# Altium project pca10090.PrjPCB (part 4 of 5)

## Sheet pca10090_sheet7_sim_connectors.SchDoc: PCA10090 - SIM & Connectors
size A3; Organization: Nordic Semiconductor; DocumentNumber: 7; Revision: 0.15.0; SheetNumber: 7; SheetTotal: 8; Author: RUBR; CompanyName: Nordic Semiconductor; DrawnBy: RUBR; DocumentSize: A3; ProjectName: nRF9160-DK
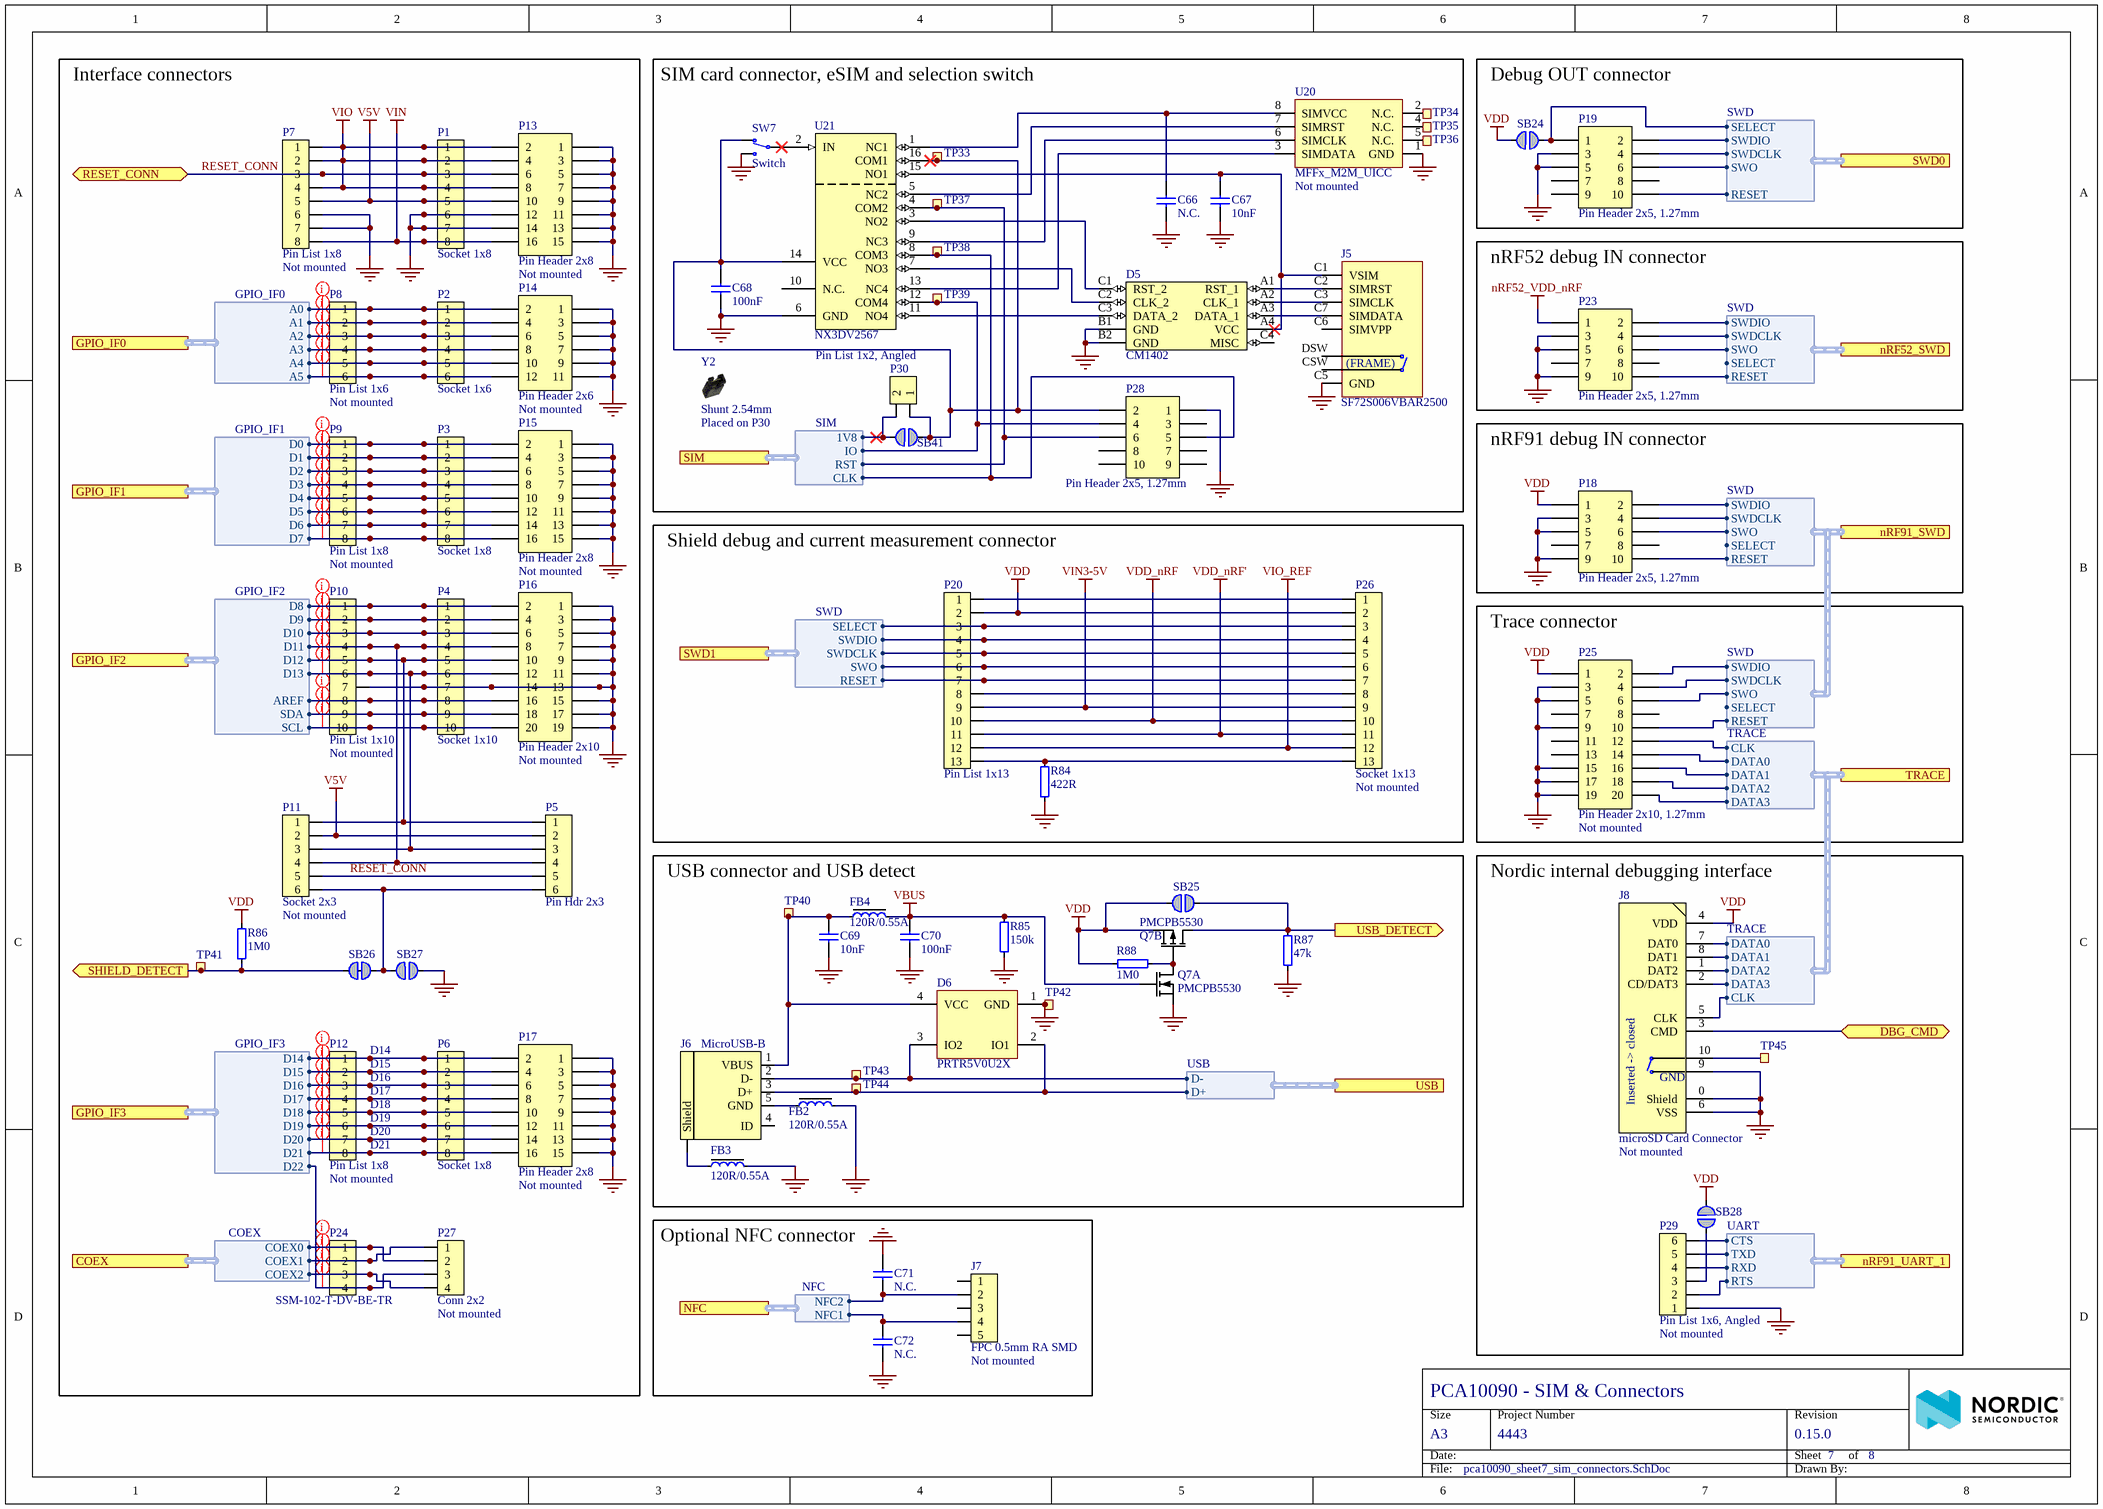
[diagram p6: pca10090_sheet7_sim_connectors.SchDoc]

### Parts
C66  N.C.  [CAPC0603X03L_C_NC]
C67  10nF  [CAPC0603X03L_C]
C68  100nF  [CAPC0603X03L_C]
C69  10nF  [CAPC0603X03L_C]
C70  100nF  [CAPC0603X03L_C]
C71  N.C.  [CAPC0603X03L_C_NC]
C72  N.C.  [CAPC0603X03L_C_NC]
D5  CM1402  [CM1402]
D6  PRTR5V0U2X  [SOT190P230X110-4L]
FB2  120R/0.55A  [INDC1005X04L]
FB3  120R/0.55A  [INDC1005X04L]
FB4  120R/0.55A  [INDC1005X04L]
J5  SF72S006VBAR2500  [SF72S006VBAR2500]
J6  MicroUSB-B  [USB-Micro-B-RA-SMD-PiP]
J7  FPC 0.5mm RA SMD  Assembly: Not mounted  [FPC_05P-0.5mm-RA-SMD]
J8  microSD Card Connector  Assembly: Not mounted  [Molex_502774-0891]
P1  Socket 1x8  [SOCKET_1x8_SMD]
P2  Socket 1x6  [SOCKET_1x6_SMD]
P3  Socket 1x8  [SOCKET_1x8_SMD]
P4  Socket 1x10  [SOCKET_1x10_SMD]
P5  Pin Hdr 2x3  [HDR_2x3-SMD]
P6  Socket 1x8  [SOCKET_1x8_SMD]
P7  Pin List 1x8  Assembly: Not mounted  [LIST_1x8_SMD-NC]
P8  Pin List 1x6  Assembly: Not mounted  [LIST_1x6_SMD-NC]
P9  Pin List 1x8  Assembly: Not mounted  [LIST_1x8_SMD-NC]
P10  Pin List 1x10  Assembly: Not mounted  [LIST_1x10_SMD-NC]
P11  Socket 2x3  Assembly: Not mounted  [SOCKET_2x3_SMD-2.54mm-bottom-NC]
P12  Pin List 1x8  Assembly: Not mounted  [LIST_1x8_SMD-NC]
P13  Pin Header 2x8  Assembly: Not mounted  [HDR_2x8-NC]
P14  Pin Header 2x6  Assembly: Not mounted  [HDR_2x6-NC]
P15  Pin Header 2x8  Assembly: Not mounted  [HDR_2x8-NC]
P16  Pin Header 2x10  Assembly: Not mounted  [HDR_2x10-NC]
P17  Pin Header 2x8  Assembly: Not mounted  [HDR_2x8-NC]
P18  Pin Header 2x5, 1.27mm  [HDR_2x5-SMD-1.27mm-K]
P19  Pin Header 2x5, 1.27mm  [HDR_2x5-SMD-1.27mm-K]
P20  Pin List 1x13  [LIST_1x13_SMD]
P23  Pin Header 2x5, 1.27mm  [HDR_2x5-SMD-1.27mm-K]
P24  SSM-102-T-DV-BE-TR  [SSM-102-T-DV-BE-TR]
P25  Pin Header 2x10, 1.27mm  Assembly: Not mounted  [HDR_2x10-SMD-1.27mm-NC]
P26  Socket 1x13  Assembly: Not mounted  [LIST_1x13_SMD-NC]
P27  Conn 2x2  Assembly: Not mounted  [HDR_2x2-SMD]
P28  Pin Header 2x5, 1.27mm  [HDR_2x5-SMD-1.27mm]
P29  Pin List 1x6, Angled  Assembly: Not mounted  [LIST_ANG_1x6-SMD-2.54MM]
P30  Pin List 1x2, Angled  [LIST_ANG_1x2-SMD-2.54MM]
Q7  PMCPB5530  [PMCPB5530X]  (parts A,B of 2)
R84  422R  [RESC0603X03L_C]
R85  150k  [RESC0603X03L_C]
R86  1M0  [RESC0603X03L_C]
R87  47k  [RESC0603X03L_C]
R88  1M0  [RESC0603X03L_C]
SB24  Solderbridge  [Solderbridge]  (value not drawn)  (no BOM)
SB25  Solderbridge  [Solderbridge]  (value not drawn)  (no BOM)
SB26  Solderbridge  [Solderbridge_Shorted]  (value not drawn)  (net tie, no BOM)
SB27  Solderbridge  [Solderbridge]  (value not drawn)  (no BOM)
SB28  Solderbridge  [Solderbridge]  (value not drawn)  (no BOM)
SB41  Solderbridge  [Solderbridge]  (value not drawn)  (no BOM)
SW7  Switch  [CJS-120xA]
TP33  Ø1.5mm,SMD  [TP_SMD_Ø1.5mm]  (value not drawn)  (no BOM)
TP34  Ø1.0mm,SMD  [TP_SMD_Ø1.0mm]  (value not drawn)  (no BOM)
TP35  Ø1.0mm,SMD  [TP_SMD_Ø1.0mm]  (value not drawn)  (no BOM)
TP36  Ø1.0mm,SMD  [TP_SMD_Ø1.0mm]  (value not drawn)  (no BOM)
TP37  Ø1.5mm,SMD  [TP_SMD_Ø1.5mm]  (value not drawn)  (no BOM)
TP38  Ø1.5mm,SMD  [TP_SMD_Ø1.5mm]  (value not drawn)  (no BOM)
TP39  Ø1.5mm,SMD  [TP_SMD_Ø1.5mm]  (value not drawn)  (no BOM)
TP40  Ø1.5mm,SMD  [TP_SMD_Ø1.5mm]  (value not drawn)  (no BOM)
TP41  Ø1.5mm,SMD  [TP_SMD_Ø1.5mm]  (value not drawn)  (no BOM)
TP42  Ø1.5mm,SMD  [TP_SMD_Ø1.5mm]  (value not drawn)  (no BOM)
TP43  Ø1.5mm,SMD  [TP_SMD_Ø1.5mm]  (value not drawn)  (no BOM)
TP44  Ø1.5mm,SMD  [TP_SMD_Ø1.5mm]  (value not drawn)  (no BOM)
TP45  Ø1.5mm,SMD  [TP_SMD_Ø1.5mm]  (value not drawn)  (no BOM)
U20  MFFx_M2M_UICC  Assembly: Not mounted  [SON127P600X90_HS-8N]
U21  NX3DV2567  [XQFN40P180X260X50-16N]
Y2  Shunt 2.54mm  Assembly: Placed on P30  [Shunt_2.54mm_Horizontal]

### Blocks framed on the sheet
Interface connectors: P1-P17 P24 P27 R86 SB26 SB27 TP41
SIM card connector, eSIM and selection switch: C66-C68 D5 J5 P28 P30 SB41 SW7 TP33-TP39 U20 U21 Y2
Debug OUT connector: P19 SB24
nRF52 debug IN connector: P23
nRF91 debug IN connector: P18
Shield debug and current measurement connector: P20 P26 R84
Trace connector: P25
USB connector and USB detect: C69 C70 D6 FB2-FB4 J6 Q7 R85 R87 R88 SB25 TP40 TP42-TP44
Nordic internal debugging interface: J8 P29 SB28 TP45
Optional NFC connector: C71 C72 J7

### Ports
COEX (harness COEX), DBG_CMD (bidir), GPIO_IF0 (harness GPIO_IF0), GPIO_IF1 (harness GPIO_IF1), GPIO_IF2 (harness GPIO_IF2), GPIO_IF3 (harness GPIO_IF3), NFC (harness NFC), nRF52_SWD (harness SWD), nRF91_SWD (harness SWD), nRF91_UART_1 (harness UART), RESET_CONN (bidir), SHIELD_DETECT (out), SIM (harness SIM), SWD0 (harness SWD), SWD1 (harness SWD), TRACE (harness TRACE), USB (harness USB), USB_DETECT (out)

### Harnesses
SWD: SWDIO, SWDCLK, SWO, RESET, SELECT
GPIO_IF0: A0, A1, A2, A3, A4, A5
GPIO_IF1: D0, D1, D2, D3, D4, D5, D6, D7
GPIO_IF2: D8, D9, D10, D11, D12, D13, AREF, SDA, SCL
GPIO_IF3: D14, D15, D16, D17, D18, D19, D20, D21, D22
NFC: NFC1, NFC2
COEX: COEX0, COEX2, COEX1
TRACE: CLK, DATA0, DATA1, DATA3, DATA2
SIM: CLK, IO, 1V8, RST
USB: D+, D-
UART: RTS, CTS, RXD, TXD

### Nets
GND: C66.1 C67.2 C68.1 C69.1 C70.1 C71.2 C72.1 D5.B1(GND) D5.B2(GND) D6.1(GND) FB2.2 FB3.2 J5.0(GND) J5.C5(GND) J8.0(Shield) J8.6(VSS) J8.9 P1.6 P1.7 P4.7 P7.6 P7.7 P10.7 P13.1 P13.3 P13.5 P13.7 P13.9 P13.11 P13.12 P13.13 P13.14 P13.15 P14.1 P14.3 P14.5 P14.7 P14.9 P14.11 P15.1 P15.3 P15.5 P15.7 P15.9 P15.11 P15.13 P15.15 P16.1 P16.3 P16.5 P16.7 P16.9 P16.11 P16.13 P16.14 P16.15 P16.17 P16.19 P17.1 P17.3 P17.5 P17.7 P17.9 P17.11 P17.13 P17.15 P18.3 P18.5 P18.9 P19.3 P19.5 P23.3 P23.5 P23.9 P25.3 P25.5 P25.9 P25.15 P25.17 P25.19 P28.1 P29.1 Q7.1(S1) R84.1 R85.1 R87.1 SB27.1 SW7.3(N.O) TP42.1 U20.1(GND) U21.6(GND)
nRF52_VDD_nRF: P23.1
V5V: P1.5 P5.2 P7.5 P11.2 P13.10
VBUS: C70.2 FB4.2 Q7.2(G1) R85.2
VDD: J8.4(VDD) P18.1 P20.2 P25.1 P26.2 Q7.4(S2) R86.2 R88.1 SB24.2 SB25.1 SB28.1
VDD_nRF: P20.10 P26.10
VDD_nRF': P20.11 P26.11
VIN: P1.8 P7.8 P13.16
VIN3-5V: P20.9 P26.9
VIO: P1.1 P1.2 P1.4 P7.1 P7.2 P7.4 P13.2 P13.4 P13.8
VIO_REF: P20.12 P26.12
COEX1: P24.2 P27.1 ; port COEX.COEX1
COEX2: P24.3 P27.4 ; port COEX.COEX2
D_N: D6.3(IO2) J6.2(D-) TP43.1 ; port USB.D-
D_P: D6.2(IO1) J6.3(D+) TP44.1 ; port USB.D+
GPS_EN: P24.1 P27.2 ; port COEX.COEX0
nRF52_P0.02/AIN0: R86.1 SB26.2 TP41.1 ; port SHIELD_DETECT
nRF52_P0.09/NFC1: C72.2 J7.4 ; port NFC.NFC1
nRF52_P0.10/NFC2: C71.1 J7.2 ; port NFC.NFC2
nRF52_P0.18/RESET: P23.10 ; port nRF52_SWD.RESET
nRF52_P1.00: P23.6 ; port nRF52_SWD.SWO
nRF52_SWDCLK: P23.4 ; port nRF52_SWD.SWDCLK
nRF52_SWDIO: P23.2 ; port nRF52_SWD.SWDIO
P0.00: P3.1 P9.1 P15.2 ; port GPIO_IF1.D0
P0.01: P3.2 P9.2 P15.4 ; port GPIO_IF1.D1
P0.02: P3.3 P9.3 P15.6 ; port GPIO_IF1.D2
P0.03: P3.4 P9.4 P15.8 ; port GPIO_IF1.D3
P0.04: P3.5 P9.5 P15.10 ; port GPIO_IF1.D4
P0.05: P3.6 P9.6 P15.12 ; port GPIO_IF1.D5
P0.06: P3.7 P9.7 P15.14 ; port GPIO_IF1.D6
P0.07: P3.8 P9.8 P15.16 ; port GPIO_IF1.D7
P0.08: P4.1 P10.1 P16.2 ; port GPIO_IF2.D8
P0.09: P4.2 P10.2 P16.4 ; port GPIO_IF2.D9
P0.10: P4.3 P10.3 P16.6 ; port GPIO_IF2.D10
P0.11: P4.4 P5.4 P10.4 P11.4 P16.8 ; port GPIO_IF2.D11
P0.12: P4.5 P5.1 P10.5 P11.1 P16.10 ; port GPIO_IF2.D12
P0.13/AIN0: P4.6 P5.3 P10.6 P11.3 P16.12 ; port GPIO_IF2.D13
P0.14/AIN1: P2.1 P8.1 P14.2 ; port GPIO_IF0.A0
P0.15/AIN2: P2.2 P8.2 P14.4 ; port GPIO_IF0.A1
P0.16/AIN3: P2.3 P8.3 P14.6 ; port GPIO_IF0.A2
P0.17/AIN4: P2.4 P8.4 P14.8 ; port GPIO_IF0.A3
P0.18/AIN5: P2.5 P8.5 P14.10 ; port GPIO_IF0.A4
P0.19/AIN6: P2.6 P8.6 P14.12 ; port GPIO_IF0.A5
P0.20/AIN7: P4.8 P10.8 P16.16 ; port GPIO_IF2.AREF
P0.21: J8.5(CLK) P6.1 P12.1 P17.2 P25.12 ; port GPIO_IF3.D14, port TRACE.CLK
P0.22: J8.7(DAT0) P6.2 P12.2 P17.4 P18.6 P25.6 P25.14 ; port nRF91_SWD.SWO, port GPIO_IF3.D15, port TRACE.DATA0
P0.23: J8.8(DAT1) P6.3 P12.3 P17.6 P25.16 ; port GPIO_IF3.D16, port TRACE.DATA1
P0.24: J8.1(DAT2) P6.4 P12.4 P17.8 P25.18 ; port GPIO_IF3.D17, port TRACE.DATA2
P0.25: J8.2(CD/DAT3) P6.5 P12.5 P17.10 P25.20 ; port GPIO_IF3.D18, port TRACE.DATA3
P0.26: P6.6 P12.6 P17.12 P29.6 ; port GPIO_IF3.D19, port nRF91_UART_1.CTS
P0.27: P6.7 P12.7 P17.14 P29.2 ; port GPIO_IF3.D20, port nRF91_UART_1.RTS
P0.28: P6.8 P12.8 P17.16 P29.4 ; port GPIO_IF3.D21, port nRF91_UART_1.RXD
P0.29: P24.4 P27.3 P29.5 ; port GPIO_IF3.D22, port nRF91_UART_1.TXD
P0.30: P4.9 P10.9 P16.18 ; port GPIO_IF2.SDA
P0.31: P4.10 P10.10 P16.20 ; port GPIO_IF2.SCL
RESET: P18.10 P25.10 ; port nRF91_SWD.RESET
RESET_CONN: P1.3 P5.5 P7.3 P11.5 P13.6 ; port RESET_CONN
SIM_1V8: P30.2 SB41.1 ; port SIM.1V8
SIM_CLK: P28.5 TP38.1 U21.8(COM3) ; port SIM.CLK
SIM_IO: P28.4 TP39.1 U21.12(COM4) ; port SIM.IO
SIM_RST: P28.6 TP37.1 U21.4(COM2) ; port SIM.RST
SWD0_CLK: P19.4 ; port SWD0.SWDCLK
SWD0_IO: P19.2 ; port SWD0.SWDIO
SWD0_RESET: P19.10 ; port SWD0.RESET
SWD0_SEL: P19.1 SB24.1 ; port SWD0.SELECT
SWD0_SWO: P19.6 ; port SWD0.SWO
SWD1_CLK: P20.5 P26.5 ; port SWD1.SWDCLK
SWD1_IO: P20.4 P26.4 ; port SWD1.SWDIO
SWD1_RESET: P20.7 P26.7 ; port SWD1.RESET
SWD1_SEL: P20.3 P26.3 ; port SWD1.SELECT
SWD1_SWO: P20.6 P26.6 ; port SWD1.SWO
SWDCLK: P18.4 P25.4 ; port nRF91_SWD.SWDCLK
SWDIO: P18.2 P25.2 ; port nRF91_SWD.SWDIO
NetC66_2: C66.2 U20.8(SIMVCC) U21.1(NC1)
NetC67_1: C67.1 D5.A4(VCC) J5.C1(VSIM) U21.15(NO1)
NetC68_2: C68.2 P28.2 P30.1 SB41.2 SW7.1(N.C) TP33.1 U21.14(VCC) U21.16(COM1)
NetC69_2: C69.2 D6.4(VCC) FB4.1 J6.1(VBUS) TP40.1
NetD5_A1: D5.A1(RST_1) J5.C2(SIMRST)
NetD5_A2: D5.A2(CLK_1) J5.C3(SIMCLK)
NetD5_A3: D5.A3(DATA_1) J5.C7(SIMDATA)
NetD5_C1: D5.C1(RST_2) U21.3(NO2)
NetD5_C2: D5.C2(CLK_2) U21.7(NO3)
NetD5_C3: D5.C3(DATA_2) U21.11(NO4)
NetFB2_1: FB2.1 J6.5(GND)
NetFB3_1: FB3.1 J6.6(Shield)
NetJ8_3: J8.3(CMD) ; port DBG_CMD
NetJ8_10: J8.10 TP45.1
NetP5_6: P5.6 P11.6 SB26.1 SB27.2
NetP20_1: P20.1 P26.1
NetP20_8: P20.8 P26.8
NetP20_13: P20.13 P26.13 R84.2
NetP29_3: P29.3 SB28.2
NetQ7_3: Q7.3(D2) R87.2 SB25.2 ; port USB_DETECT
NetQ7_5: Q7.5(G2) Q7.6(D1) R88.2
NetSW7_2: SW7.2(COM) U21.2(IN)
NetTP34_1: TP34.1 U20.2(N.C.)
NetTP35_1: TP35.1 U20.4(N.C.)
NetTP36_1: TP36.1 U20.5(N.C.)
NetU20_3: U20.3(SIMDATA) U21.13(NC4)
NetU20_6: U20.6(SIMCLK) U21.9(NC3)
NetU20_7: U20.7(SIMRST) U21.5(NC2)

Not connected (* = marked no-connect by the designer): D5 C4(MISC); J5 C6(SIMVPP) CSW DSW; J6 4(ID); J7 1 3 5; P18 7 8; P19 7 8 9; P23 7 8; P25 7 8 11 13; P28 3 7 8 9 10; U21 10(N.C.)

### Layout directives
net class GPIO: COEX1, COEX2, GPS_EN, P0.00, P0.01, P0.02, P0.03, P0.04, P0.05, P0.06, P0.07, P0.08, P0.09, P0.10, P0.11, P0.12, P0.13/AIN0, P0.14/AIN1, P0.15/AIN2, P0.16/AIN3, P0.17/AIN4, P0.18/AIN5, P0.19/AIN6, P0.20/AIN7, P0.21, P0.22, P0.23, P0.24, P0.25, P0.26, P0.27, P0.28, P0.29, P0.30, P0.31

### Notes on the sheet
- (near P12) D14
- (near P12) D15
- (near P12) D16
- (near P12) D17
- (near P12) D18
- (near P12) D19
- (near P12) D20
- (near P12) D21
- Size
- Date:
- A3
- Project Number
- Sheet         of
- Revision
- File:
- Drawn By:
- (in symbol Bellwether 10104-1021) GND; Inserted -> closed
- (in symbol SF72S006VBAR2500) (FRAME)

### Library data of the parts
C66 C71 C72 = C0201-N.C.: Not mounted; Note: Chip Cap; Artikkelnr Noca: N.A.; Assembly: Not mounted; Part Number: C0201-N.C.; Manufacturer: *; Manufacturer Part Number: *; ComponentLink1URL: *; ComponentLink1Description: Datasheet; ComponentLink2URL: *; ComponentLink2Description: Supplier link; HelpURL: *; Footprint Doc: 0201; LatestRevisionDate: 2014-11-13; Pin Count: 2; Publisher: Nordic Semiconductor; Published: 2014-11-13; Value: N.C.; Part number IPS: N.A.; Supplier 1: *; Supplier Part Number 1: *; Supplier 2: *; Supplier Part Number 2: *
C67 C69 = C0201-10n: Capacitor, X7R, ±10%; Part number IPS: 00000003480; Note: 10V; Artikkelnr Noca: N.A.; Part Number: C0201-10n; Manufacturer: *; Manufacturer Part Number: *; ComponentLink1URL: *; ComponentLink1Description: Datasheet; ComponentLink2URL: *; ComponentLink2Description: Supplier link; HelpURL: *; Footprint Doc: 0201; LatestRevisionDate: 2017-11-09; Pin Count: 2; Publisher: Nordic Semiconductor; Published: 2014-11-13; Value: 10nF; Supplier 1: *; Supplier Part Number 1: *; Supplier 2: *; Supplier Part Number 2: *
C68 C70 = C0201-100n: as C48-C55 on sheet pca10090_sheet5_signal_switches; Part Number: C0201-100n; Manufacturer: *; Manufacturer Part Number: *; ComponentLink1URL: *; ComponentLink1Description: Datasheet; ComponentLink2URL: *; ComponentLink2Description: Supplier link; HelpURL: *; Footprint Doc: 0201; LatestRevisionDate: 2017-11-09; Pin Count: 2; Publisher: Nordic Semiconductor; Published: 2014-11-13; Value: 100nF; Supplier 1: *; Supplier Part Number 1: *; Supplier 2: *; Supplier Part Number 2: *
D5 = CM1402: EMI Network Filter Arrays SIM CARD EMI FILTER WITH ESD PROTECTION; Manufacturer: ON Semiconductor; Manufacturer Part Number: CM1402-03CP; Part number IPS: 00000009949; Artikkelnr Noca: N.A.; Part Number: CM1402; Footprint Doc: CM1402; LatestRevisionDate: 2017-02-06; Publisher: Nordic Semiconductor; Published: 2017-02-06; Value: CM1402; Note: *; ComponentLink1URL: *; ComponentLink1Description: Datasheet; ComponentLink2URL: *; ComponentLink2Description: Supplier link; HelpURL: http://www.onsemi.com/pub_link/Collateral/CM1402-D.PDF; Pin Count: 10; Supplier 1: Digi-Key; Supplier Part Number 1: CM1402-03CPOSTR-ND; Supplier 2: Mouser; Supplier Part Number 2: 748-CM1402-03CP
D6 = PRTR5V0U2X: Ultra low capacitance double rail-to-rail ESD protection diode; Manufacturer: NXP; Part number IPS: 00000009951; Artikkelnr Noca: 10069015; Part Number: PRTR5V0U2X; Manufacturer Part Number: PRTR5V0U2X; LatestRevisionDate: 2017-11-09; Publisher: Nordic Semiconductor; Published: 2012-06-11; Value: PRTR5V0U2X; Note: *; Footprint Doc: SOT-143B; ComponentLink1URL: *; ComponentLink1Description: Datasheet; ComponentLink2URL: *; ComponentLink2Description: Supplier link; HelpURL: http://www.farnell.com/datasheets/109718.pdf; Pin Count: 4; Supplier 1: Digi-Key; Supplier Part Number 1: 568-4140-1-ND; Supplier 2: Farnell; Supplier Part Number 2: 152-4157
FB2-FB4 = FB0402-120R@100M-500mA: Ferrite Bead, 120 Ohm @ 100MHz, 500mA, 250 mOhm Max; Manufacturer: Murata; Manufacturer Part Number: BLM15AG121SN1D; Part number IPS: 00000009954; Note: Chip EMIFIL Inductor Type Chip Ferrite Bead; Artikkelnr Noca: 33029317; Part Number: FB0402-120R@100M-500mA; Footprint Doc: 0402; LatestRevisionDate: 2014-01-10; Pin Count: 2; Publisher: Nordic Semiconductor; Published: 2011-11-14; Value: 120R/0.55A; ComponentLink1URL: *; ComponentLink1Description: Datasheet; ComponentLink2URL: *; ComponentLink2Description: Supplier link; HelpURL: http://search.murata.co.jp/Ceramy/image/img/PDF/ENG/L0110S0100BLM15A_SN.pdf; Supplier 1: Digi-Key; Supplier Part Number 1: 490-1005-1-ND; Supplier 2: Farnell; Supplier Part Number 2: 151-5760
J5 = SF72S006VBAR2500: n 8 (6 + 2) Position Card Connector NANO SIM Surface Mount, Right Angle Gold; Manufacturer: JAE; Part number IPS: 00000009956; Artikkelnr Noca: N.A.; Part Number: SF72S006VBAR2500; Manufacturer Part Number: SF72S006VBAR2500; Footprint Doc: SF72S006VBAR2500; LatestRevisionDate: 2016-09-09; Pin Count: 8; Publisher: Nordic Semiconductor; Published: 2016-09-09; Value: SF72S006VBAR2500; Note: *; ComponentLink1URL: *; ComponentLink1Description: Datasheet; ComponentLink2URL: *; ComponentLink2Description: Supplier link; HelpURL: http://jae-connectors.com/en/pdf/MB-0282-1E_SF72.pdf; Supplier 1: Digi-Key; Supplier Part Number 1: 670-2799-1-ND; Supplier 2: Mouser; Supplier Part Number 2: 656-SF72S006VBAR2500
J6 = USB-Micro-B-RA-SMD-PiP: MicroUSB-B-SMT; Manufacturer: Allen Creations Corp.; Manufacturer Part Number: AJU55-BS2111-L; Part number IPS: 00000007790; Artikkelnr Noca: 55029020; Part Number: USB-Micro-B-RA-SMD-PiP; Footprint Doc: USB-Micro-B-RA-SMD-PiP; LatestRevisionDate: 2016-04-21; Pin Count: 5; Publisher: Nordic Semiconductor; Published: 2014-10-07; Value: MicroUSB-B; Note: *; ComponentLink1URL: *; ComponentLink1Description: Datasheet; ComponentLink2URL: *; ComponentLink2Description: Supplier link; HelpURL: \\hizz\pro\app9717\Datasheet\connectors\Allen Creations Corp\AJU-211.pdf; Supplier 1: Cabcon; Supplier Part Number 1: AJU55-BS2111-L; Supplier 2: Digi-Key; Supplier Part Number 2: 609-4616-1-ND
J7 = FPC_05P-0.5mm-RA-SMD: 0.5mm FPC, 5P,Right Angle SMT,Double Contact,H=1.2mm,White, Tin plated; Manufacturer: W-CON; Manufacturer Part Number: 5141-05RZDNWR01; Part number IPS: 00000007792; Artikkelnr Noca: 55010020; Part Number: FPC_05P-0.5mm-RA-SMD; Footprint Doc: FPC_05P-0.5mm-RA-SMD; LatestRevisionDate: 2016-04-21; Pin Count: 7; Publisher: Nordic Semiconductor; Published: 2015-06-22; Value: FPC 0.5mm RA SMD; Note: *; ComponentLink1URL: *; ComponentLink1Description: Datasheet; ComponentLink2URL: *; ComponentLink2Description: Supplier link; HelpURL: \\hizz\pro\app9717\Datasheet\connectors\W-CON\5141-XXRZDNXX0X.pdf; Supplier 1: Cabcon; Supplier Part Number 1: 5141-05RZDNWR01; Supplier 2: Digi-Key; Supplier Part Number 2: WM9836CT-ND
J8 = Bellwether 10104-1021: 1.10mm Pitch microSD Memory Card Connector, Reverse Mount Surface Mount, Push-Push Type; Artikkelnr Noca: N.A.; Part Number: Bellwether 10104-1021; Manufacturer: Bellwether; Manufacturer Part Number: 10104-1021; ComponentLink1URL: *; ComponentLink1Description: Datasheet; ComponentLink2URL: *; ComponentLink2Description: Supplier link; HelpURL: *; Footprint Doc: MicroSD; LatestRevisionDate: 2020-06-12; Pin Count: 14; Publisher: Nordic Semiconductor; Published: 2020-06-12; Value: microSD Card Connector; Note: *; Supplier 1: Cabcon; Supplier Part Number 1: 10104-1021; Supplier 2: *; Supplier Part Number 2: *; Part number IPS: N.A.
P1 P3 P6 = Socket 1x8 SMD: Socket 1x8, 2.54mm (100mil), SMD; Manufacturer: W-CON; Manufacturer Part Number: 2171-108MS0CUNR1; Part number IPS: 00000009963; Artikkelnr Noca: 55030002; Part Number: Socket 1x8 SMD; Footprint Doc: SOCKET_1x8_SMD; LatestRevisionDate: 2017-10-23; Pin Count: 8; Publisher: Nordic Semiconductor; Published: 2016-01-22; Value: Socket 1x8; Note: *; ComponentLink1URL: *; ComponentLink1Description: Datasheet; ComponentLink2URL: *; ComponentLink2Description: Supplier link; HelpURL: *; Supplier 1: Cabcon; Supplier Part Number 1: 2171-108MS0CUNR1; Supplier 2: Samtec; Supplier Part Number 2: SSM-108-F-SV-P-TR
P2 = Socket 1x6 SMD: Socket 1x6, 2.54mm (100mil), SMD; Manufacturer: W-CON; Manufacturer Part Number: 2171-106MS0CUNR1; Part number IPS: 00000009964; Artikkelnr Noca: 55030001; Part Number: Socket 1x6 SMD; Footprint Doc: SOCKET_1x6_SMD; LatestRevisionDate: 2017-10-23; Pin Count: 6; Publisher: Nordic Semiconductor; Published: 2016-01-22; Value: Socket 1x6; Note: *; ComponentLink1URL: *; ComponentLink1Description: Datasheet; ComponentLink2URL: *; ComponentLink2Description: Supplier link; HelpURL: *; Supplier 1: Cabcon; Supplier Part Number 1: 2171-106MS0CUNR1; Supplier 2: Samtec; Supplier Part Number 2: SSM-106-F-SV-P-TR
P4 = Socket 1x10 SMD: Socket 1x10, 2.54mm (100mil), SMD; Manufacturer: W-CON; Manufacturer Part Number: 2171-110MS0CUNR1; Part number IPS: 00000009965; Artikkelnr Noca: 55030004; Part Number: Socket 1x10 SMD; Footprint Doc: SOCKET_1x10_SMD; LatestRevisionDate: 2016-01-22; Pin Count: 10; Publisher: Nordic Semiconductor; Published: 2016-01-22; Value: Socket 1x10; Note: *; ComponentLink1URL: *; ComponentLink1Description: Datasheet; ComponentLink2URL: *; ComponentLink2Description: Supplier link; HelpURL: *; Supplier 1: Cabcon; Supplier Part Number 1: 2171-110MS0CUNR1; Supplier 2: Samtec; Supplier Part Number 2: SSM-110-F-SV-P-TR
P5 = Pin Header 2x3 SMD: Pin Header 2x3, 2.54mm (100mil) SMD; Manufacturer: W-CON; Manufacturer Part Number: 1125-1203S0M116R1; Part number IPS: 00000009966; Artikkelnr Noca: 55010007; Part Number: Pin Header 2x3 SMD; Footprint Doc: HDR_2x3-SMD; LatestRevisionDate: 2016-01-22; Pin Count: 6; Publisher: Nordic Semiconductor; Published: 2016-01-22; Value: Pin Hdr 2x3; Note: SMD; ComponentLink1URL: *; ComponentLink1Description: Datasheet; ComponentLink2URL: *; ComponentLink2Description: Supplier link; HelpURL: \\hizz\pro\app9717\Datasheet\connectors\W-CON\1125-12XXXXMXXXXX.PDF; Supplier 1: Cabcon; Supplier Part Number 1: 1125-1203S0M116R1; Supplier 2: Samtec; Supplier Part Number 2: TSM-103-01-L-DV
P7 P9 P12 = Pin List 1x8 SMD, N.C.: Pin List 1x8, 2.54mm (100mil), SMD; Manufacturer: W-CON; Manufacturer Part Number: 1125-1108S0M116R2; Part number IPS: N.A.; Artikkelnr Noca: 55010006; Part Number: Pin List 1x8 SMD, N.C.; LatestRevisionDate: 2016-01-22; Publisher: Nordic Semiconductor; Published: 2016-01-22; Value: Pin List 1x8; Note: *; Pin Count: 8; Footprint Doc: LIST_1x8_SMD; ComponentLink1URL: *; ComponentLink1Description: Datasheet; ComponentLink2URL: *; ComponentLink2Description: Supplier link; HelpURL: \\hizz\pro\app9717\Datasheet\connectors\W-CON\1125-11XXXXMXXXXX.pdf; Supplier 1: Cabcon; Supplier Part Number 1: 1125-1108S0M116R2; Supplier 2: Samtec; Supplier Part Number 2: TSM-108-01-L-SV-P-TR
P8 = Pin List 1x6 SMD, N.C.: Pin List 1x6, 2.54mm (100mil), SMD; Manufacturer: W-CON; Manufacturer Part Number: 1125-1106S0M116R2; Part number IPS: N.A.; Artikkelnr Noca: 55010026; Part Number: Pin List 1x6 SMD, N.C.; LatestRevisionDate: 2016-03-29; Pin Count: 6; Publisher: Nordic Semiconductor; Published: 2016-03-29; Value: Pin List 1x6; Note: *; Footprint Doc: LIST_1x6_SMD; ComponentLink1URL: *; ComponentLink1Description: Datasheet; ComponentLink2URL: *; ComponentLink2Description: Supplier link; HelpURL: \\hizz\pro\app9717\Datasheet\connectors\W-CON\1125-11XXXXMXXXXX.pdf; Supplier 1: Cabcon; Supplier Part Number 1: 1125-1106S0M116R2; Supplier 2: Samtec; Supplier Part Number 2: TSM-106-01-L-SV-P-TR
P10 = Pin List 1x10 SMD, N.C.: Pin List 1x10, 2.54mm (100mil), SMD; Manufacturer: W-CON; Manufacturer Part Number: 1125-1110S0M116R2; Part number IPS: N.A.; Artikkelnr Noca: 55010028; Part Number: Pin List 1x10 SMD, N.C.; LatestRevisionDate: 2016-03-29; Publisher: Nordic Semiconductor; Published: 2016-03-29; Value: Pin List 1x10; Note: *; Pin Count: 10; Footprint Doc: LIST_1x10_SMD; ComponentLink1URL: *; ComponentLink1Description: Datasheet; ComponentLink2URL: *; ComponentLink2Description: Supplier link; HelpURL: \\hizz\pro\app9717\Datasheet\connectors\W-CON\1125-11XXXXMXXXXX.pdf; Supplier 1: Cabcon; Supplier Part Number 1: 1125-1110S0M116R2; Supplier 2: Samtec; Supplier Part Number 2: TSM-110-01-L-SV-P-TR
P11 = Socket 2x3 SMD Bottom, N.C.: Socket 2x3, 2.54mm (100mil), SMD; Manufacturer: W-CON; Manufacturer Part Number: 2171-203MS0CUNR1; Part number IPS: N.A.; Artikkelnr Noca: 55030010; Part Number: Socket 2x3 SMD Bottom, N.C.; LatestRevisionDate: 2016-03-29; Pin Count: 6; Publisher: Nordic Semiconductor; Published: 2014-06-10; Value: Socket 2x3; Note: *; Footprint Doc: SOCKET_2x3_SMD-2.54mm-bottom; ComponentLink1URL: *; ComponentLink1Description: Datasheet; ComponentLink2URL: *; ComponentLink2Description: Supplier link; HelpURL: \\hizz\pro\app9717\Datasheet\connectors\W-CON\2171-2XXMXXCUNXX.pdf; Supplier 1: Cabcon; Supplier Part Number 1: 2171-203MS0CUNR1; Supplier 2: Samtec; Supplier Part Number 2: SSM-103-F-DV-P-TR
P13 P15 P17 = Pin Header 2x8, N.C.: Pin Header 2x8, 2.54mm (100mil); Artikkelnr Noca: N.A.; Part Number: Pin Header 2x8, N.C.; Manufacturer: *; Manufacturer Part Number: *; Footprint Doc: HDR_2x8; LatestRevisionDate: 2009-12-12; Pin Count: 16; Publisher: Nordic Semiconductor; Published: 2009-12-12; Value: Pin Header 2x8; Note: *; Part number IPS: N.A.; ComponentLink1URL: *; ComponentLink1Description: Datasheet; ComponentLink2URL: *; ComponentLink2Description: Supplier link; HelpURL: *; Supplier 1: *; Supplier Part Number 1: *; Supplier 2: *; Supplier Part Number 2: *
P14 = Pin Header 2x6, N.C.: Pin Header 2x6, 2.54mm (100mil); Artikkelnr Noca: N.A.; Part Number: Pin Header 2x6, N.C.; Manufacturer: *; Manufacturer Part Number: *; Footprint Doc: HDR_2x6; LatestRevisionDate: 2014-07-04; Pin Count: 12; Publisher: Nordic Semiconductor; Published: 2009-12-12; Value: Pin Header 2x6; Note: *; Part number IPS: N.A.; ComponentLink1URL: *; ComponentLink1Description: Datasheet; ComponentLink2URL: *; ComponentLink2Description: Supplier link; HelpURL: *; Supplier 1: *; Supplier Part Number 1: *; Supplier 2: *; Supplier Part Number 2: *
P16 = Pin Header 2x10, N.C.: Pin Header 2x10, 2.54mm (100mil); Artikkelnr Noca: N.A.; Part Number: Pin Header 2x10, N.C.; Manufacturer: *; Manufacturer Part Number: *; Footprint Doc: HDR_2x10; LatestRevisionDate: 2017-02-02; Pin Count: 20; Publisher: Nordic Semiconductor; Published: 2017-01-30; Value: Pin Header 2x10; Note: *; Part number IPS: N.A.; ComponentLink1URL: *; ComponentLink1Description: Datasheet; ComponentLink2URL: *; ComponentLink2Description: Supplier link; HelpURL: *; Supplier 1: *; Supplier Part Number 1: *; Supplier 2: *; Supplier Part Number 2: *
P18 P19 P23 = Pin Header 2x5 SMD, 1.27mm, KS: Pin Header 2x5, 1.27mm (50mil), SMD, Keying Shroud; Manufacturer: W-CON; Manufacturer Part Number: 3132-10MS0BK00R1; Part number IPS: 00000009968; Artikkelnr Noca: 55010009; Part Number: Pin Header 2x5 SMD, 1.27mm, KS; Footprint Doc: HDR_2x5-SMD-1.27mm; LatestRevisionDate: 2016-04-21; Pin Count: 10; Publisher: Nordic Semiconductor; Published: 2016-01-22; Value: Pin Header 2x5, 1.27mm; Note: *; ComponentLink1URL: *; ComponentLink1Description: Datasheet; ComponentLink2URL: *; ComponentLink2Description: Supplier link; HelpURL: \\hizz\pro\app9717\Datasheet\connectors\W-CON\3132-XXMXXBK00XX.pdf; Supplier 1: Cabcon; Supplier Part Number 1: 3132-10MS0BK00R1; Supplier 2: Samtec; Supplier Part Number 2: FTSH-105-01-F-DV-K
P20 = Pin List 1x13 SMD: Pin List 1x13, 2.54mm (100mil), SMD; Part number IPS: 00000002499; Artikkelnr Noca: N.A.; Part Number: Pin List 1x13 SMD; Manufacturer: *; Manufacturer Part Number: *; Footprint Doc: LIST_1x13_SMD; LatestRevisionDate: 2015-11-10; Pin Count: 13; Publisher: Nordic Semiconductor; Published: 2015-11-10; Value: Pin List 1x13; Note: *; ComponentLink1URL: *; ComponentLink1Description: Datasheet; ComponentLink2URL: *; ComponentLink2Description: Supplier link; HelpURL: *; Supplier 1: Cabcon; Supplier Part Number 1: 1125-1113S0M116R2; Supplier 2: Samtec; Supplier Part Number 2: TSM-113-01-L-SV-P-TR
P24 = 2171-202MSNCUNR1: .025 SOCKET STRIPS; Manufacturer: WCON; Part number IPS: 00000001417; Artikkelnr Noca: N.A.; Part Number: 2171-202MSNCUNR1; Manufacturer Part Number: 2171-202MSNCUNR1; ComponentLink1URL: https://www.samtec.com/partnumber/ssm-102-t-dv-be-tr?vendor=digikey; ComponentLink1Description: Datasheet; ComponentLink2URL: *; ComponentLink2Description: Supplier link; HelpURL: *; Footprint Doc: SSM-102-T-DV-BE-TR; LatestRevisionDate: 2018-06-07; Pin Count: 4; Publisher: Nordic Semiconductor; Published: 2018-06-07; Value: SSM-102-T-DV-BE-TR; Note: *; Supplier 1: Cabcon; Supplier Part Number 1: 2171-202MSNCUNR1; Supplier 2: Digi-Key; Supplier Part Number 2: SSM-102-T-DV-BE-TR-ND
P25 = Pin Header 2x10 SMD, 1.27mm, KS, N.C.: Pin Header 2x10, 1.27mm (50mil), SMD, Keying Shroud; Manufacturer: W-CON; Manufacturer Part Number: 3132-20MS0BK00R1; Artikkelnr Noca: N.A.; Part Number: Pin Header 2x10 SMD, 1.27mm, KS, N.C.; LatestRevisionDate: 2017-10-23; Pin Count: 20; Publisher: Nordic Semiconductor; Published: 2017-09-07; Value: Pin Header 2x10, 1.27mm; Note: *; Footprint Doc: HDR_2x10-SMD-1.27mm; Part number IPS: N.A.; ComponentLink1URL: *; ComponentLink1Description: Datasheet; ComponentLink2URL: *; ComponentLink2Description: Supplier link; HelpURL: *; Supplier 1: Cabcon; Supplier Part Number 1: 3132-20MS0BK00R1; Supplier 2: Digi-Key; Supplier Part Number 2: FTSH-110-01-F-DV-K-ND
P26 = Socket 1x13 SMD, N.C.: Socket 1x13, 2.54mm (100mil), SMD; Manufacturer: W-CON; Manufacturer Part Number: 2171-113MS0CUNR1; Artikkelnr Noca: N.A.; Part Number: Socket 1x13 SMD, N.C.; Footprint Doc: SOCKET_1x13_SMD; LatestRevisionDate: 2019-05-27; Pin Count: 13; Publisher: Nordic Semiconductor; Published: 2019-05-27; Value: Socket 1x13; Note: *; Part number IPS: N.A.; ComponentLink1URL: *; ComponentLink1Description: Datasheet; ComponentLink2URL: *; ComponentLink2Description: Supplier link; HelpURL: *; Supplier 1: Cabcon; Supplier Part Number 1: 2171-113MS0CUNR1; Supplier 2: Samtec; Supplier Part Number 2: SSM-113-L-SV-P-TR
P27 = HDR_2x2_SMD_GOLD: CONN HEADER 4POS .100" VERT 15AU; Manufacturer: Molex; Note: SMD, gold plating; Artikkelnr Noca: N.A.; Part Number: HDR_2x2_SMD_GOLD; Manufacturer Part Number: 15-91-0040; ComponentLink1URL: *; ComponentLink1Description: Datasheet; ComponentLink2URL: *; ComponentLink2Description: Supplier link; HelpURL: http://www.molex.com/pdm_docs/sd/015910040_sd.pdf; Footprint Doc: HDR_2x2-SMD; LatestRevisionDate: 2012-05-06; Pin Count: 4; Publisher: Nordic Semiconductor; Published: 2012-05-06; Value: Conn 2x2; Part number IPS: N.A.; Supplier 1: Digi-Key; Supplier Part Number 1: 0015910040-ND; Supplier 2: *; Supplier Part Number 2: *
P28 = Pin Header 2x5 SMD, 1.27mm: Pin Header 2x5, 1.27mm (50mil), SMD; Manufacturer: W-CON; Manufacturer Part Number: 1325-1205S0M078R1; Part number IPS: 00000009970; Artikkelnr Noca: 55019196; Part Number: Pin Header 2x5 SMD, 1.27mm; Footprint Doc: HDR_2x5-SMD-1.27mm; LatestRevisionDate: 2016-04-21; Pin Count: 10; Publisher: Nordic Semiconductor; Published: 2010-11-25; Value: Pin Header 2x5, 1.27mm; Note: *; ComponentLink1URL: *; ComponentLink1Description: Datasheet; ComponentLink2URL: *; ComponentLink2Description: Supplier link; HelpURL: http://www.farnell.com/datasheets/81359.pdf; Supplier 1: Cabcon; Supplier Part Number 1: 1325-1205S0M078R1; Supplier 2: Farnell; Supplier Part Number 2: 166-7759
P29 = Pin List Ang 1x6 SMD, 2.54mm: Pin List 1x6, 2.54mm (100mil), Right Angled, SMD; Artikkelnr Noca: N.A.; Part Number: Pin List Ang 1x6 SMD, 2.54mm; Manufacturer: *; Manufacturer Part Number: *; ComponentLink1URL: *; ComponentLink1Description: Datasheet; ComponentLink2URL: *; ComponentLink2Description: Supplier link; HelpURL: *; Footprint Doc: LIST_ANG_1x6-SMD-2.54MM; LatestRevisionDate: 2015-01-23; Pin Count: 6; Publisher: Nordic Semiconductor; Published: 2015-01-23; Value: Pin List 1x6, Angled; Note: *; Supplier 1: Samtec; Supplier Part Number 1: TSM-106-01-L-SH-A; Supplier 2: Digi-Key; Supplier Part Number 2: S1113E-06-ND; Part number IPS: N.A.
P30 = Pin List Ang 1x2 SMD, 2.54mm: Pin List 1x2, 2.54mm (100mil), Right Angled, SMD; Manufacturer: W-CON; Manufacturer Part Number: 1125B-1102S0Z135R2; Part number IPS: 00000009972; Artikkelnr Noca: 55010023; Part Number: Pin List Ang 1x2 SMD, 2.54mm; ComponentLink1URL: *; ComponentLink1Description: Datasheet; ComponentLink2URL: *; ComponentLink2Description: Supplier link; HelpURL: \\hizz\pro\app9717\Datasheet\connectors\W-CON\1125B-11XXXXZXXXXX.pdf; Footprint Doc: LIST_ANG_1x2-SMD-2.54MM; LatestRevisionDate: 2016-05-26; Pin Count: 2; Publisher: Nordic Semiconductor; Published: 2016-01-22; Value: Pin List 1x2, Angled; Note: *; Supplier 1: Cabcon; Supplier Part Number 1: 1125B-1102S0Z135R2; Supplier 2: Samtec; Supplier Part Number 2: TSM-102-01-L-SH-A
Q7 = PMCPB5530X,115: Mosfet Array N and P-Channel 20V 4A (Ta), 3.4A (Ta) 490mW Surface Mount 6-HUSON-EP (2x2); Manufacturer: Nexperia; Part number IPS: 00000001918; Artikkelnr Noca: N.A.; Part Number: PMCPB5530X,115; Manufacturer Part Number: PMCPB5530X,115; LatestRevisionDate: 2018-04-30; Pin Count: 8; Publisher: Nordic Semiconductor; Published: 2018-04-30; Value: PMCPB5530; Note: *; Footprint Doc: 6-UDFN; ComponentLink1URL: https://assets.nexperia.com/documents/data-sheet/PMCPB5530X.pdf; ComponentLink1Description: Datasheet; ComponentLink2URL: https://www.digikey.com/product-detail/en/nexperia-usa-inc/PMCPB5530X115/1727-1327-1-ND/4386339; ComponentLink2Description: Supplier link; HelpURL: https://www.nexperia.com/products/mosfets/small-signal-mosfets/PMCPB5530X.html; Supplier 1: Digi-Key; Supplier Part Number 1: 1727-1327-1-ND; Supplier 2: Mouser; Supplier Part Number 2: 771-PMCPB5530X115
R84 = R0201-422: Resistor, ±1%, 0.05W; Part number IPS: 00000002996; Note: Chip Res 1%; Artikkelnr Noca: N.A.; Part Number: R0201-422; Manufacturer: *; Manufacturer Part Number: *; ComponentLink1URL: *; ComponentLink1Description: Datasheet; ComponentLink2URL: *; ComponentLink2Description: Supplier link; HelpURL: *; Footprint Doc: 0201; LatestRevisionDate: 2019-07-16; Pin Count: 2; Publisher: Nordic Semiconductor; Published: 2019-07-16; Value: 422R; Supplier 1: *; Supplier Part Number 1: *; Supplier 2: *; Supplier Part Number 2: *
R85 = R0201-150k: Resistor, ±1%, 0.05W; Part number IPS: 00000001422; Note: Chip Res 1%; Artikkelnr Noca: N.A.; Part Number: R0201-150k; Manufacturer: *; Manufacturer Part Number: *; ComponentLink1URL: *; ComponentLink1Description: Datasheet; ComponentLink2URL: *; ComponentLink2Description: Supplier link; HelpURL: *; Footprint Doc: 0201; LatestRevisionDate: 2014-11-13; Pin Count: 2; Publisher: Nordic Semiconductor; Published: 2014-11-13; Value: 150k; Supplier 1: *; Supplier Part Number 1: *; Supplier 2: *; Supplier Part Number 2: *
R86 R88 = R0201-1M0: Resistor, ±1%, 0.05W; Part number IPS: 00000001418; Note: Chip Res 1%; Artikkelnr Noca: N.A.; Part Number: R0201-1M0; Manufacturer: *; Manufacturer Part Number: *; ComponentLink1URL: *; ComponentLink1Description: Datasheet; ComponentLink2URL: *; ComponentLink2Description: Supplier link; HelpURL: *; Footprint Doc: 0201; LatestRevisionDate: 2014-11-13; Pin Count: 2; Publisher: Nordic Semiconductor; Published: 2014-11-13; Value: 1M0; Supplier 1: *; Supplier Part Number 1: *; Supplier 2: *; Supplier Part Number 2: *
R87 = R0201-47k: Resistor, ±1%, 0.05W; Part number IPS: 00000001423; Note: Chip Res 1%; Artikkelnr Noca: N.A.; Part Number: R0201-47k; Manufacturer: *; Manufacturer Part Number: *; ComponentLink1URL: *; ComponentLink1Description: Datasheet; ComponentLink2URL: *; ComponentLink2Description: Supplier link; HelpURL: *; Footprint Doc: 0201; LatestRevisionDate: 2014-11-13; Pin Count: 2; Publisher: Nordic Semiconductor; Published: 2014-11-13; Value: 47k; Supplier 1: *; Supplier Part Number 1: *; Supplier 2: *; Supplier Part Number 2: *
SB24 SB25 SB27 SB28 SB41 = Solderbridge: Artikkelnr Noca: N.A.; Part Number: Solderbridge; Manufacturer: *; Manufacturer Part Number: *; Footprint Doc: Solderbridge; LatestRevisionDate: 2009-12-14; Pin Count: 2; Publisher: Nordic Semiconductor; Published: 2009-12-14; Value: Solderbridge; Note: *; Part number IPS: N.A.; ComponentLink1URL: *; ComponentLink1Description: Datasheet; ComponentLink2URL: *; ComponentLink2Description: Supplier link; HelpURL: *; Supplier 1: *; Supplier Part Number 1: *; Supplier 2: *; Supplier Part Number 2: *
SB26 = Solderbridge Shorted: as SB11-SB14 on sheet pca10090_sheet5_signal_switches; Part Number: Solderbridge Shorted; Manufacturer: *; Manufacturer Part Number: *; Footprint Doc: Solderbridge_Shorted; LatestRevisionDate: 2012-08-07; Pin Count: 2; Publisher: Nordic Semiconductor; Published: 2012-08-07; Value: Solderbridge; Note: *; Part number IPS: N.A.; ComponentLink1URL: *; ComponentLink1Description: Datasheet; ComponentLink2URL: *; ComponentLink2Description: Supplier link; HelpURL: *; Supplier 1: *; Supplier Part Number 1: *; Supplier 2: *; Supplier Part Number 2: *
SW7 = CJS-1200TA: SMD slide Switch (ON-ON); Manufacturer: Copal Electronics Inc; Part number IPS: 00000009982; Artikkelnr Noca: 50019068; Part Number: CJS-1200TA; Manufacturer Part Number: CJS-1200TA; Footprint Doc: CJS-120xA; LatestRevisionDate: 2012-10-03; Pin Count: 3; Publisher: Nordic Semiconductor; Published: 2012-10-03; Value: Switch; Note: *; ComponentLink1URL: *; ComponentLink1Description: Datasheet; ComponentLink2URL: *; ComponentLink2Description: Supplier link; HelpURL: http://media.digikey.com/pdf/Data%20Sheets/COPAL%20Electronics%20PDFs/CJS.pdf; Supplier 1: Digi-Key; Supplier Part Number 1: 563-1021-2-ND; Supplier 2: *; Supplier Part Number 2: *
TP33 TP37-TP45 = TP_SMD_Ø1.5MM: as TP20-TP27 on sheet pca10090_sheet5_signal_switches; Part Number: TP_SMD_Ø1.5MM; Manufacturer Part Number: *; ComponentLink1URL: *; ComponentLink1Description: Datasheet; ComponentLink2URL: *; ComponentLink2Description: Supplier link; HelpURL: *; Footprint Doc: TP_SMD_Ø1.5mm; LatestRevisionDate: 2016-06-02; Pin Count: 1; Publisher: Nordic Semiconductor; Published: 2016-06-02; Value: Ø1.5mm,SMD; Note: *; Part number IPS: N.A.; Supplier 1: *; Supplier Part Number 1: *; Supplier 2: *; Supplier Part Number 2: *
TP34-TP36 = TP_SMD_Ø1.0MM: 1.0mm circular SMD testpad; Manufacturer: Nordic Semiconductor; Artikkelnr Noca: N.A.; Part Number: TP_SMD_Ø1.0MM; Manufacturer Part Number: *; Footprint Doc: TP_SMD_Ø1.0mm; LatestRevisionDate: 2013-06-11; Pin Count: 1; Publisher: Nordic Semiconductor; Published: 2013-06-11; Value: Ø1.0mm,SMD; Note: *; Part number IPS: N.A.; ComponentLink1URL: *; ComponentLink1Description: Datasheet; ComponentLink2URL: *; ComponentLink2Description: Supplier link; HelpURL: *; Supplier 1: *; Supplier Part Number 1: *; Supplier 2: *; Supplier Part Number 2: *
U20 = M2M_UICC: M2M UICC SIM Card; Artikkelnr Noca: N.A.; Part Number: M2M_UICC; Manufacturer: *; Manufacturer Part Number: *; Pin Count: 8; Value: M2M UICC; Footprint Doc: SON-8; ComponentLink1Description: Datasheet; ComponentLink1URL: *; ComponentLink2Description: Supplier link; ComponentLink2URL: *; HelpURL: *; LatestRevisionDate: 2019-10-22; Note: *; Part number IPS: N.A.; Published: 2019-10-22; Publisher: Nordic Semiconductor; Supplier 1: *; Supplier 2: *; Supplier Part Number 1: *; Supplier Part Number 2: *
U21 = NX3DV2567GU: Low-ohmic four-pole double-throw analog switch; Manufacturer: NXP Semiconductors; Part number IPS: 00000007816; Artikkelnr Noca: 15079317; Part Number: NX3DV2567GU; Manufacturer Part Number: NX3DV2567GU; Footprint Doc: XQFN-16; LatestRevisionDate: 2015-02-17; Pin Count: 16; Publisher: Nordic Semiconductor; Published: 2015-02-17; Value: NX3DV2567; Note: *; ComponentLink1URL: *; ComponentLink1Description: Datasheet; ComponentLink2URL: *; ComponentLink2Description: Supplier link; HelpURL: http://www.nxp.com/documents/data_sheet/NX3DV2567.pdf; Supplier 1: Digi-Key; Supplier Part Number 1: 568-5206-1-ND; Supplier 2: Mouser; Supplier Part Number 2: 771-NX3DV2567GU115
Y2 = SHUNT JUMPER 2.54mm BLACK GOLD Horizontal: Shunt Jumper 2.54mm; Part number IPS: 00000001916; Note: SHUNT JUMPER .1" BLACK GOLD, h=6.00mm, w=5.00mm; Artikkelnr Noca: 56099001; Part Number: SHUNT JUMPER 2.54mm BLACK GOLD Horizontal; Manufacturer: *; Manufacturer Part Number: *; ComponentLink1URL: *; ComponentLink1Description: Datasheet; ComponentLink2URL: *; ComponentLink2Description: Supplier link; HelpURL: *; Footprint Doc: SHUNT JUMPER 2.54mm; LatestRevisionDate: 2019-09-04; Pin Count: 2; Publisher: Nordic Semiconductor; Published: 2019-09-04; Value: Shunt 2.54mm; Supplier 1: Digi-Key; Supplier Part Number 1: S9001-ND, or similar; Supplier 2: *; Supplier Part Number 2: *